# Altium project RFID_PCB.PrjPcb
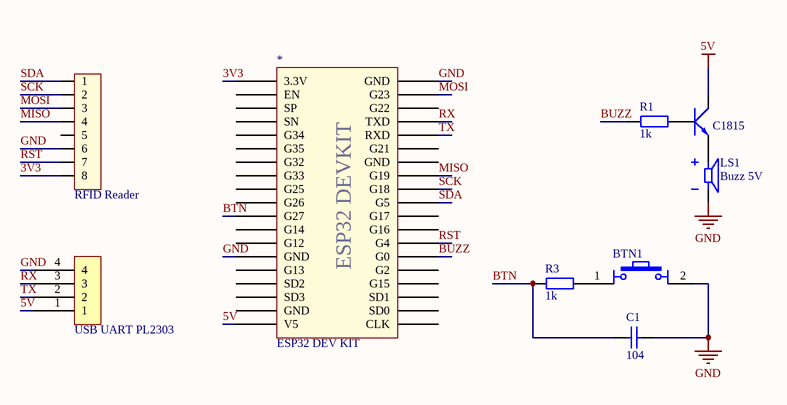
[diagram p0: RFID_SCH.SchDoc]
1 sheet, 9 parts. Net scope: global (net labels, ports and power ports of the same name join across sheets).
Board file: RFID_PCB.PcbDoc

## Sheet RFID_SCH.SchDoc
size A; SheetNumber: 1; SheetTotal: 1

### Parts
(Parts that share a designator on the sheet are numbered #1, #2 ... from top to bottom, then left to right.)
*  ESP32 DEV KIT  [ESP32 DEVKIT]
?#1  C1815  [TO92]
?#2  USB UART PL2303  [Header-4P-7.62mm]
BTN1  (no value)  [Nut Nhan 4 Chan Cam 6x6]
C1  104  [tu gom]
H1  RFID Reader  [Header 8P DC 2.54]
LS1  Buzz 5V  [CUI_CMI-1295-0585T]
R1  1k  [tro vach 1/2w]
R3  1k  [tro vach 1/2w]

### Nets
5V: *.19(V5) ?#1.2(C) ?#2.1
GND: *.14(GND) *.38(GND) ?#2.4 BTN1.2 C1.1 H1.6 LS1.N
3V3: *.1(3.3V) H1.8
BTN: *.11(G27) C1.2 R3.1
BUZZ: *.25(G0) R1.1
MISO: *.31(G19) H1.4
MOSI: *.37(G23) H1.3
RST: *.26(G4) H1.7
RX: *.35(TXD) ?#2.3
SCK: *.30(G18) H1.2
SDA: *.29(G5) H1.1
TX: *.34(RXD) ?#2.2
Net?#1_1: ?#1.1(E) LS1.P
Net?#1_3: ?#1.3(B) R1.2
NetBTN1_1: BTN1.1 R3.2

Not connected (* = marked no-connect by the designer): * 2(EN) 3(SP) 4(SN) 5(G34) 6(G35) 7(G32) 8(G33) 9(G25) 10(G26) 12(G14) 13(G12) 15(G13) 16(SD2) 17(SD3) 18(GND) 20(CLK) 21(SD0) 22(SD1) 23(G15) 24(G2) 27(G16) 28(G17) 32(GND) 33(G21) 36(G22); H1 5

### Notes on the sheet
- (in symbol ESP32 DEV KIT) ESP32 DEVKIT

### Library data of the parts
?#1 = Trans C1815 DIP: NPN transistor; Value: C9014
?#2 = Header-4P-7.62mm
BTN1 = Nut Nhan 4 Chan Cam 6x6: Nut Nhan 4 Chan 6x6mm; Ten: Nút Nhấn 4 Chân 6x6x5MM DIP; Ma_Hang: MH004584
C1 = Tu gom 104 50V: Cắm; So_Chan: 2; Ten_Linh_Kien: Tụ gốm 104 100nF 50V; Don_Vi: Con; Ma_Hang: MH004761; Chung_Loai: Cắm; Kieu_Chan: *
H1 = Header 8P 2.54 Duc Cong: Cắm; Ten_Linh_Kien: Header 8P XH2.54-8P Đực Cong; Don_Vi: Con; Ma_Hang: MH003367; Chung_Loai: Cắm
LS1 = Buzz 5V: 12 mm, 5 Vdc, 85 dB, Through Hole, Driving Circuit, Magnetic Audio Indicator Buzzer; MP: CMI-1295-0585T; MF: CUI Devices; CUI_purchase_URL: https://www.cuidevices.com/product/audio/buzzers/audio-indicators/cmi-1295-0585t?utm_source=snapeda.com&utm_medium=referral&utm_campaign=snapedaBOM; Purchase-URL: https://pricing.snapeda.com/search/part/CMI-1295-0585T/?ref=eda; Package: CUI Inc.; Availability: In Stock; Value: *; SnapEDA_Link: https://www.snapeda.com/parts/CMI-1295-0585T/CUI+Devices/view-part/?ref=snap; Price: None; Check_prices: https://www.snapeda.com/parts/CMI-1295-0585T/CUI+Devices/view-part/?ref=eda
R1 R3 = Tro Vach 1/2W 5% 1k: Cắm; Don_Vi: Con; So_Chan: 2; Ten_Linh_Kien: Trở 5% 1/2w 1K; Ma_Hang: MH007240; Chung_Loai: Cắm; Kieu_Chan: *